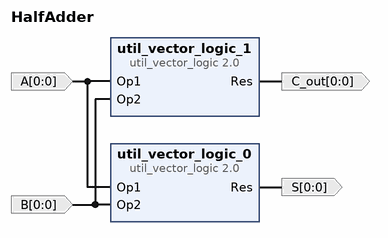
[diagram p0: block diagram of the top level]
# Vivado block design HalfAdder, xc7vx485tffg1157-1, Vivado 2019.1
create_bd_design HalfAdder

create_bd_port -dir I -from 0 -to 0 A
create_bd_port -dir I -from 0 -to 0 B
create_bd_port -dir O -from 0 -to 0 C_out
create_bd_port -dir O -from 0 -to 0 S

create_bd_cell -type ip -vlnv xilinx.com:ip:util_vector_logic:2.0 util_vector_logic_0
set_property -dict {CONFIG.C_OPERATION xor CONFIG.C_SIZE 1} [get_bd_cells util_vector_logic_0]
create_bd_cell -type ip -vlnv xilinx.com:ip:util_vector_logic:2.0 util_vector_logic_1
set_property -dict {CONFIG.C_SIZE 1} [get_bd_cells util_vector_logic_1]

# ---- connections ----

connect_bd_net [get_bd_ports A] [get_bd_pins util_vector_logic_1/Op1] [get_bd_pins util_vector_logic_0/Op1]
connect_bd_net [get_bd_ports B] [get_bd_pins util_vector_logic_1/Op2] [get_bd_pins util_vector_logic_0/Op2]
connect_bd_net [get_bd_pins util_vector_logic_0/Res] [get_bd_ports S]
connect_bd_net [get_bd_pins util_vector_logic_1/Res] [get_bd_ports C_out]

validate_bd_design
save_bd_design
